# Altium schematic sheet Mainboard_Wifi_Interface.SchDoc
size A4
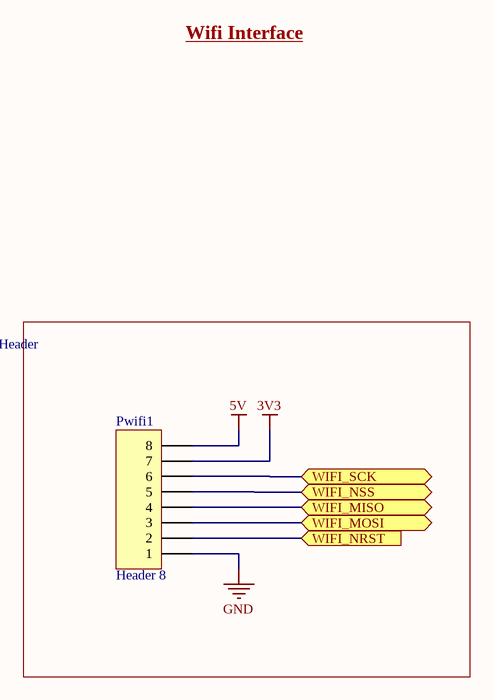
[diagram p0: Mainboard_Wifi_Interface.SchDoc]

## Parts
Pwifi1  Header 8  [HDR1X8]

## Blocks framed on the sheet
Wifi Interface Header: Pwifi1

## Ports
WIFI_MISO (bidir), WIFI_MOSI (bidir), WIFI_NRST (in), WIFI_NSS (bidir), WIFI_SCK (bidir)

## Nets
3V3: Pwifi1.7
5V: Pwifi1.8
GND: Pwifi1.1
WIFI_MISO: Pwifi1.4 ; port WIFI_MISO
WIFI_MOSI: Pwifi1.3 ; port WIFI_MOSI
WIFI_NRST: Pwifi1.2 ; port WIFI_NRST
WIFI_NSS: Pwifi1.5 ; port WIFI_NSS
WIFI_SCK: Pwifi1.6 ; port WIFI_SCK

## Notes on the sheet
- Wifi Interface

## Library data of the parts
Pwifi1 = Header 8: Header, 8-Pin; LatestRevisionDate: 17-Jul-2002; LatestRevisionNote: Re-released for DXP Platform.; Publisher: Altium Limited